# Altium schematic sheet Core.SchDoc: Wacky2021 AD19 HAT test
size A3; DrawnBy: Fletcher Walmsley; Address1: ECE Department; Address2: University of Canterbury; Address3: Christchurch 8041; Address4: New Zealand; Revision: 1
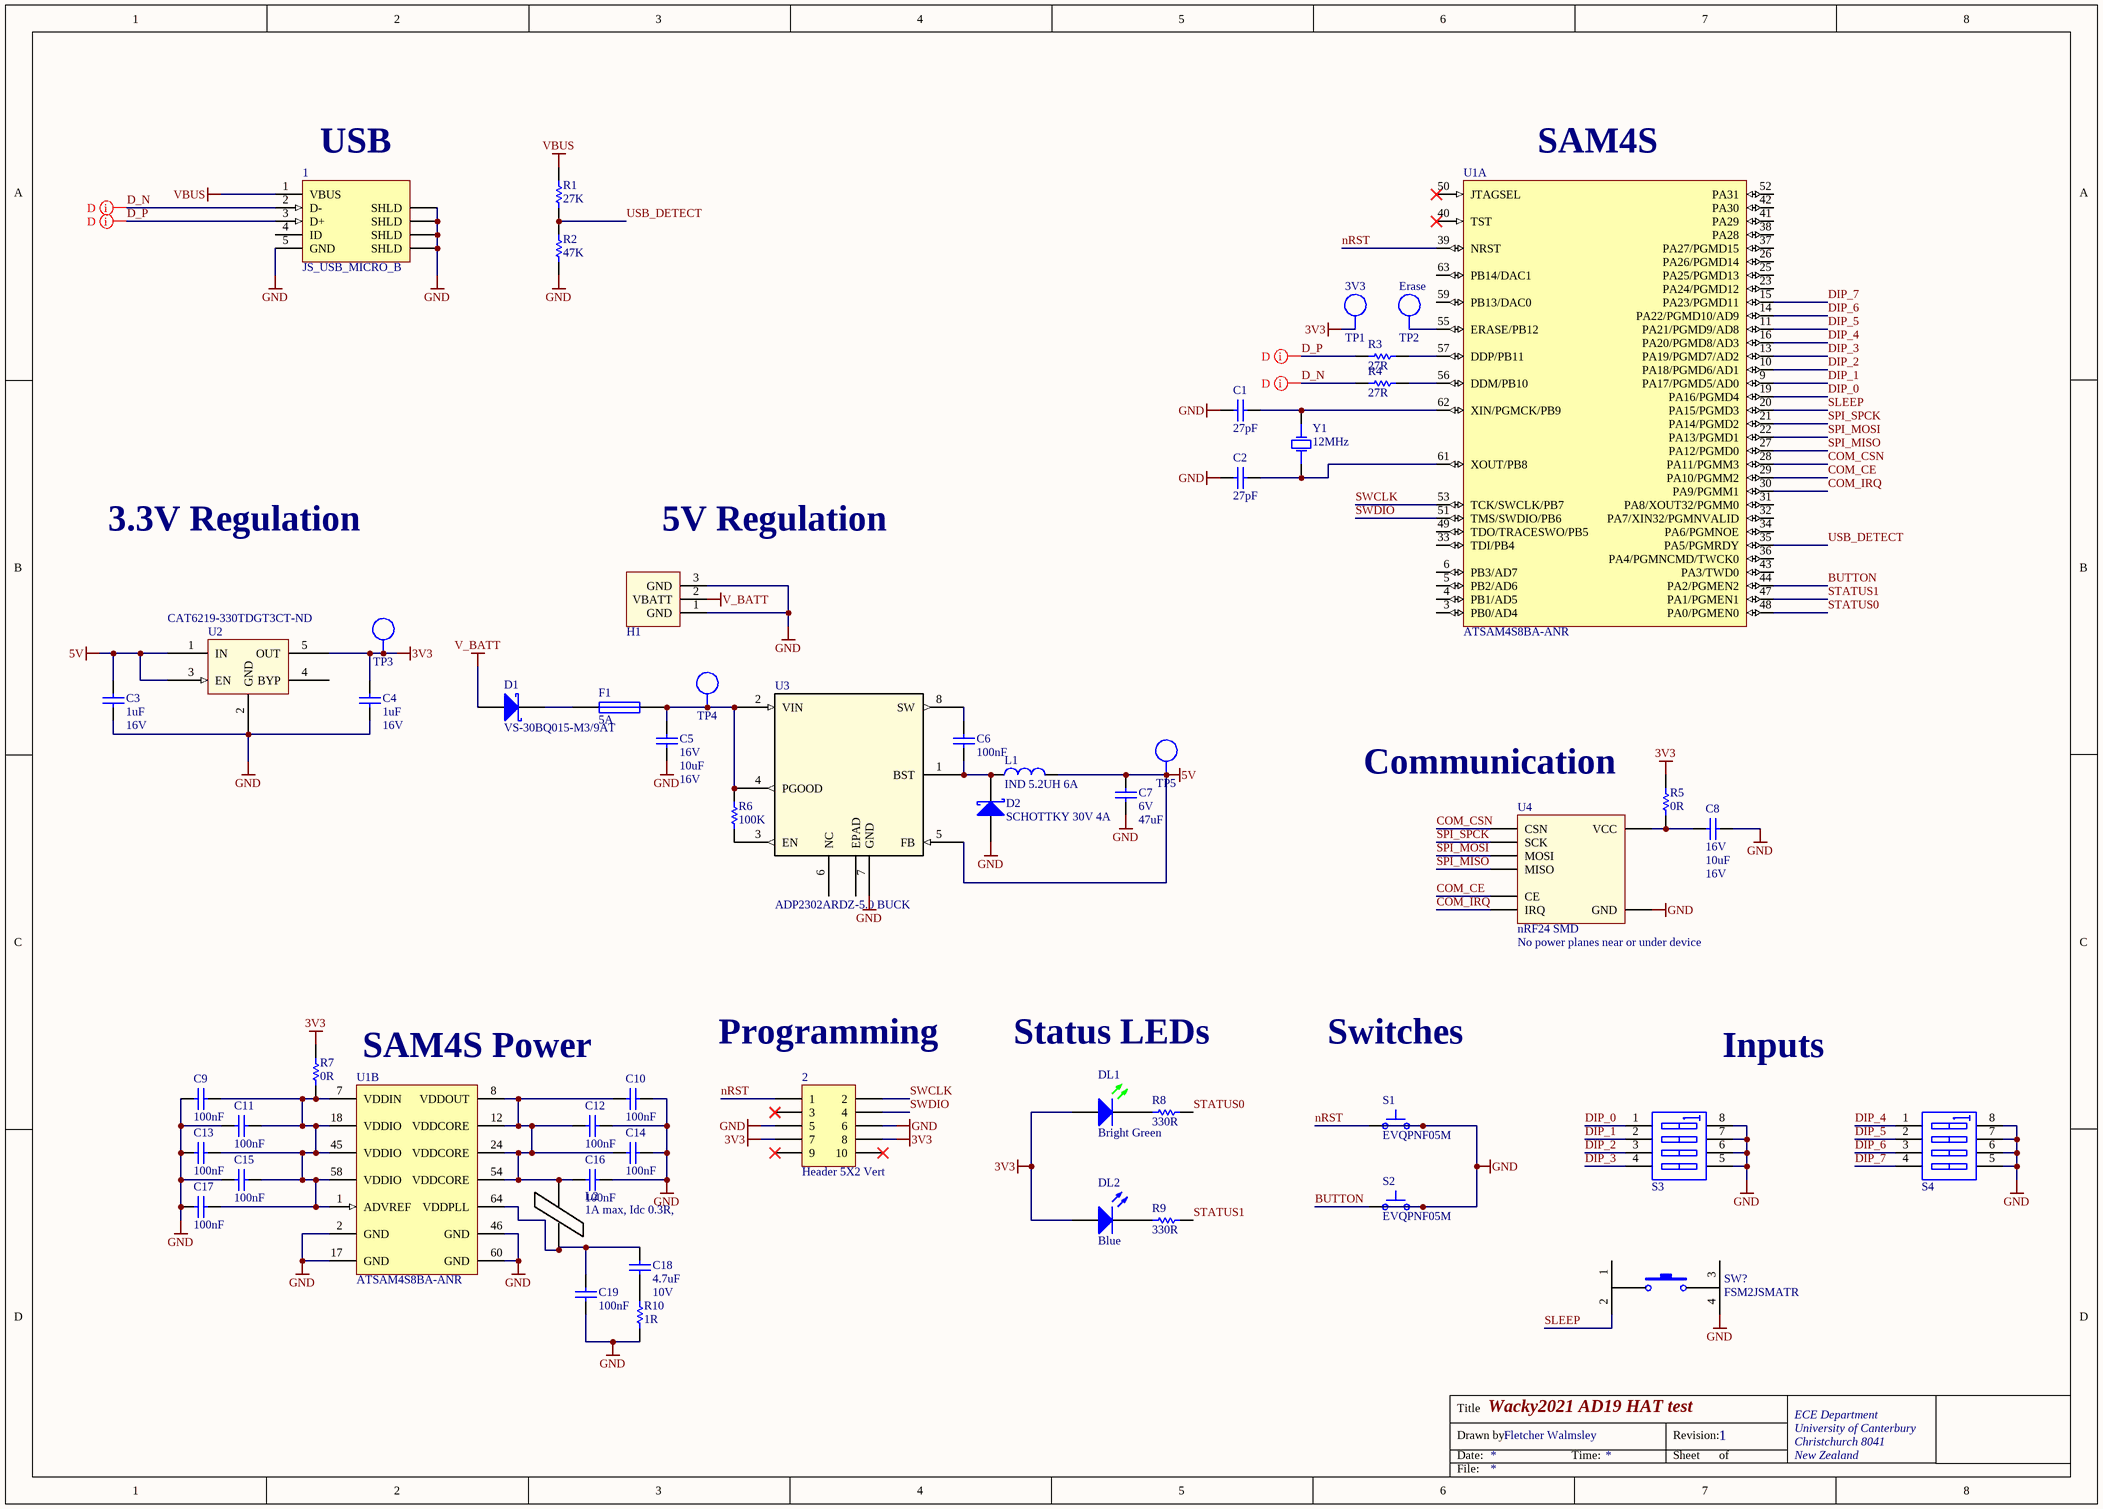
[diagram p0: Core.SchDoc]

## Parts
1  JS_USB_MICRO_B  [FCI_USB_10118194-0001LF]
2  Header 5X2 Vert  [IDC2.54-V10D]
C1  27pF  [CAPC1608L]
C2  27pF  [CAPC1608L]
C3  Max Voltage: 16V  [CAPC1608L]  (hidden comment: 1uF)
C4  Max Voltage: 16V  [CAPC1608L]  (hidden comment: 1uF)
C5  Voltage - Rated: 16V  [CAPC2012L]  (hidden comment: 10uF)
C6  100nF  [CAPC1608L]
C7  Max Voltage: 6V  [CAPC3216L]  (hidden comment: 47uF)
C8  Voltage - Rated: 16V  [CAPC2012L]  (hidden comment: 10uF)
C9  100nF  [CAPC1608L]
C10  100nF  [CAPC1608L]
C11  100nF  [CAPC1608L]
C12  100nF  [CAPC1608L]
C13  100nF  [CAPC1608L]
C14  100nF  [CAPC1608L]
C15  100nF  [CAPC1608L]
C16  100nF  [CAPC1608L]
C17  100nF  [CAPC1608L]
C18  Max Voltage: 10V  [CAPC1608N]  (hidden comment: 4.7uF)
C19  100nF  [CAPC1608L]
D1  VS-30BQ015-M3/9AT  [SMC]
D2  SCHOTTKY 30V 4A  [SMC]
DL1  Bright Green  [WL-SMCW0603]
DL2  Blue  [WL-SMCW0603]
F1  5A  [RESC3216N]
H1  Battery_HEADER_3pin  [BATT_HEADER_3POS]  (value not drawn)
L1  IND 5.2UH 6A  [INDUCTOR5u2]
L2  1A max, Idc 0.3R,  [INDC3216L]
R1  27K  [RESC1608L]
R2  47K  [RESC1608N]
R3  27R  [RESC1608L]
R4  27R  [RESC1608L]
R5  0R  [RESC1608L]
R6  100K  [RESC1608L]
R7  0R  [RESC1608L]
R8  330R  [RESC1608L]
R9  330R  [RESC1608L]
R10  1R  [RESC3216L]
S1  EVQPNF05M  [EVQPNF05M]
S2  EVQPNF05M  [EVQPNF05M]
S3  WS_SW DIP-4  [DIP_SW_4WAY_SMD -]  (value not drawn)
S4  WS_SW DIP-4  [DIP_SW_4WAY_SMD -]  (value not drawn)
SW?  FSM2JSMATR  [FSM2JSMA]
TP1  3V3  [TP_1206]  (no BOM)
TP2  Erase  [TP_1206]  (no BOM)
TP3  TP  [TP_1206]  (value not drawn)  (no BOM)
TP4  TP  [TP_1206]  (value not drawn)  (no BOM)
TP5  TP  [TP_1206]  (value not drawn)  (no BOM)
U1  ATSAM4S8BA-ANR  [LQFP64_L]  (parts A,B of 2)
U2  Supplier Part Number: CAT6219-330TDGT3CT-ND  [SOT95P280X145-5N]  (hidden comment: CAT6219-330TDGT3)
U3  ADP2302ARDZ-5.0 BUCK  [RD_8_1]
U4  nRF24 SMD  Warning: No power planes near or under device  [NRF24]
Y1  12MHz  [6.0X3.5-4]

## Nets
3V3: 2.7 2.8 C4.2 DL1.2(A) DL2.2(A) R5.2 R7.2 TP1.1 TP3.1 U2.5(OUT)
5V: C3.2 C7.2 L1.2 TP5.1 U2.1(IN) U2.3(EN) U3.5(FB)
GND: 1.5(GND) 1.6(SHLD) 2.5 2.6 C1.1 C2.1 C3.1 C4.1 C5.1 C7.1 C8.1 C9.1 C10.2 C11.1 C12.2 C13.1 C14.2 C15.1 C16.2 C17.1 C19.1 D2.1(A) H1.1(GND) H1.3(GND) R2.1 R10.1 S1.2 S2.2 S3.5(B4) S3.6(B3) S3.7(B2) S3.8(B1) S4.5(B4) S4.6(B3) S4.7(B2) S4.8(B1) SW?.4 U1.2(GND) U1.17(GND) U1.46(GND) U1.60(GND) U2.2(GND) U3.7(GND) U4.2(GND)
V_BATT: D1.1(A) H1.2(VBATT)
VBUS: 1.1(VBUS) R1.2
BUTTON: S2.1 U1.44(PA2/PGMEN2)
COM_CE: U1.29(PA10/PGMM2) U4.3(CE)
COM_CSN: U1.28(PA11/PGMM3) U4.4(CSN)
COM_IRQ: U1.30(PA9/PGMM1) U4.8(IRQ)
D_N: 1.2(D-) R4.1
D_P: 1.3(D+) R3.1
DIP_0: S3.1(A1) U1.19(PA16/PGMD4)
DIP_1: S3.2(A2) U1.9(PA17/PGMD5/AD0)
DIP_2: S3.3(A3) U1.10(PA18/PGMD6/AD1)
DIP_3: S3.4(A4) U1.13(PA19/PGMD7/AD2)
DIP_4: S4.1(A1) U1.16(PA20/PGMD8/AD3)
DIP_5: S4.2(A2) U1.11(PA21/PGMD9/AD8)
DIP_6: S4.3(A3) U1.14(PA22/PGMD10/AD9)
DIP_7: S4.4(A4) U1.15(PA23/PGMD11)
nRST: 2.1 S1.1 U1.39(NRST)
SLEEP: SW?.2 U1.20(PA15/PGMD3)
SPI_MISO: U1.27(PA12/PGMD0) U4.7(MISO)
SPI_MOSI: U1.22(PA13/PGMD1) U4.6(MOSI)
SPI_SPCK: U1.21(PA14/PGMD2) U4.5(SCK)
STATUS0: R8.2 U1.48(PA0/PGMEN0)
STATUS1: R9.2 U1.47(PA1/PGMEN1)
SWCLK: 2.2 U1.53(TCK/SWCLK/PB7)
SWDIO: 2.4 U1.51(TMS/SWDIO/PB6)
USB_DETECT: R1.1 R2.2 U1.35(PA5/PGMRDY)
NetC1_2: C1.2 U1.62(XIN/PGMCK/PB9) Y1.3(OSC2)
NetC2_2: C2.2 U1.61(XOUT/PB8) Y1.1(OSC1)
NetC5_2: C5.2 F1.2 R6.2 TP4.1 U3.2(VIN) U3.4(PGOOD)
NetC6_1: C6.1 D2.2(K) L1.1 U3.1(BST)
NetC6_2: C6.2 U3.8(SW)
NetC8_2: C8.2 R5.1 U4.1(VCC)
NetC9_2: C9.2 C11.2 C13.2 C15.2 C17.2 R7.1 U1.1(ADVREF) U1.7(VDDIN) U1.18(VDDIO) U1.45(VDDIO) U1.58(VDDIO)
NetC10_1: C10.1 C12.1 C14.1 C16.1 L2.2 U1.8(VDDOUT) U1.12(VDDCORE) U1.24(VDDCORE) U1.54(VDDCORE)
NetC18_1: C18.1 R10.2
NetC18_2: C18.2 C19.2 L2.1 U1.64(VDDPLL)
NetD1_2: D1.2(K) F1.1
NetDL1_1: DL1.1(K) R8.1
NetDL2_1: DL2.1(K) R9.1
NetR3_2: R3.2 U1.57(DDP/PB11)
NetR4_2: R4.2 U1.56(DDM/PB10)
NetR6_1: R6.1 U3.3(EN)
NetTP2_1: TP2.1 U1.55(ERASE/PB12)

Not connected (* = marked no-connect by the designer): 1 4(ID); 2 3* 9* 10*; SW? 1 3; U1 3(PB0/AD4) 4(PB1/AD5) 5(PB2/AD6) 6(PB3/AD7) 23(PA24/PGMD12) 25(PA25/PGMD13) 26(PA26/PGMD14) 31(PA8/XOUT32/PGMM0) 32(PA7/XIN32/PGMNVALID) 33(TDI/PB4) 34(PA6/PGMNOE) 36(PA4/PGMNCMD/TWCK0) 37(PA27/PGMD15) 38(PA28) 40(TST)* 41(PA29) 42(PA30) 43(PA3/TWD0) 49(TDO/TRACESWO/PB5) 50(JTAGSEL)* 52(PA31) 59(PB13/DAC0) 63(PB14/DAC1); U2 4(BYP); U3 6(NC) EPAD

## Layout directives
differential pair: D_N, D_P

## Notes on the sheet
- (near 1) USB
- (near U1) SAM4S
- 3.3V Regulation
- (near H1) 5V Regulation
- Communication
- (near U1) SAM4S Power
- (near 2) Programming
- Status LEDs
- Switches
- Inputs
- Title
- Drawn by:
- Date:
- Time:
- Revision:
- Sheet
- of
- File:

## Library data of the parts
1 = JS_USB_MICRO_B_SMT: CONN USB MICRO B RECPT SMT R/A; Manufacturer: FCI; Manufacturer Part Number: 10118194-0001LF; Gender: Receptacle; Number of Contacts: 5; Specifications: USB 2.0; Supplier 1: Digi-Key; Supplier Part Number 1: 609-4618-1-ND; Features: Shielded, Solder Retention; Mounting Type: Surface Mount, Right Angle, Horizontal
2 = JA_HDR_IDC_5X2_VERT: IDC Header, 2,54mm, 10-Pin, Vert; Supplier: ECE Dept; Supplier 1: Farnell; Supplier Part Number 1: 1096985; Storage Location: ECE Dept Store
C1 C2 = CC_27pF_0603: CAP CER 27pF NPO/COG +-5% 50V 0603; PackageReference: 0603; Code_IPC: 1608 [0603]; Verify: *; Supplier: ECE Dept; Storage Location: PCB Assembly WS; Value: 27pF
C3 C4 = CC_1uF_0603: CAP CER 1uF Y5V -20% +80% 16V 0603; PackageReference: 0603; Code_IPC: 1608 [0603]; Verify: *; Supplier: ECE Dept; Storage Location: PCB Assembly WS; Value: 1uF
C5 C8 = CC_10uF_16V_0805: CAP CER 10uF X5R 16V 0805; Manufacturer: Samsung Electro-Mechanics; Manufacturer Part Number: CL21A106KOQNNWE; Note: Footprint corresponds to dimensions for bulk cassette packaging. This case size has tightened tolerances.; Tolerance: ±10%; Notification: Current market demand for these product types have resulted in fluctuating and extending lead times. Lead times may differ.; PackageReference: 0805; Code_IPC: 2012[0805]; Supplier 1: Digi-Key; RoHS: RoHS Compliant; Category: Capacitors; Stock 1: 20000; Pricing 1: 1=0.35, 10=0.25, 100=0.1178, 500=0.08254, 1000=0.06831 (NZD); Packaging: Cut Tape (CT); Part Status: Active; Temperature Coefficient: X5R; Operating Temperature: -55°C ~ 85°C; Features: -; Ratings: -; Applications: General Purpose; Mounting Type: Surface Mount, MLCC; Package / Case: 0805 (2012 Metric); Size / Dimension: 0.079" L x 0.049" W (2.00mm x 1.25mm); Height - Seated (Max): -; Thickness (Max): 0.055" (1.40mm); Lead Spacing: -; Lead Style: -; ComponentLink1URL: http://www.samsungsem.com/kr/support/product-search/mlcc/CL21A106KOQNNWE.jsp; ComponentLink1Description: http://www.samsungsem.com/kr/support/product-search/mlcc/CL21A106KOQNNWE.jsp; Supplier Part Number 1: 1276-2894-1-ND; Value: 10uF; Max Voltage: 16V
C6 C9-C17 C19 = CC_100nF_0603: CAP CER 100nF X7R +-10% 50V 0603; PackageReference: 0603; Code_IPC: 1608 [0603]; Verify: *; Supplier: ECE Dept; Storage Location: PCB Assembly WS; Value: 100nF
C7 = CC_47uF_1206: CAP CER 47uF X5R -/+20% 6V 1206; Verify: *; Supplier: ECE Dept; Storage Location: PCB Assembly WS; Dielectric: X5R; Footprint: 1210 (3225 metric); MoV: 6V; Value: 47uF
C18 = CC_4.7uF_0603: CAP CER 4.7uF X5R +-20%  10V 0603; Note: Footprint corresponds to dimensions for bulk cassette packaging. This case size has tightened tolerances.; PackageReference: 0805; Code_IPC: 2012[0805]; Verify: *; Supplier: ECE Dept; Storage Location: PCB Assembly WS; Value: 4.7uF
D1 = DS_VS-30BQ015-M3: DIODE, SCHOTTKY, 3A, 15V, DO-214AB / SMC; Manufacturer: Vishay Semiconductors; Forward Voltage: 350mV; Max Forward Surge Current (Ifsm): 650A; Peak Reverse Current: 4mA; Average Rectified Current: 3A; Max Reverse Voltage (DC): 15V; Supplier: Digi-Key; ComponentLink1URL: https://datasheet.ciiva.com/36181/vs-30bq015-m3-9at-36181258.pdf; ComponentLink1Description: https://datasheet.ciiva.com/36181/vs-30bq015-m3-9at-36181258.pdf; Supplier 1: Digi-Key; Supplier 2: Element14; Supplier Part Number 1: VS-30BQ015-M3/9ATGIDKR-ND; Supplier Part Number 2: 2628288; Supplier Part Number: VS-30BQ015-M3/9AT-ND; Manufacturer Part Number: VS-30BQ015-M3/9AT
D2 = MBRS330T3G: DIODE SCHOTTKY 30V 4A SMC; Manufacturer: ON Semiconductor; Speed: Fast Recovery =< 500ns, > 200mA (Io); Supplier 1: Digi-Key; Manufacturer Part Number: MBRS330T3G; RoHS: RoHS Compliant; Category: Discrete Semiconductor Products; Stock 1: 8919; Pricing 1: 1=0.93, 10=0.79, 100=0.5902, 500=0.46368, 1000=0.35829 (NZD); Packaging: Cut Tape (CT); Part Status: Active; Diode Type: Schottky; Current - Average Rectified (Io): 4A; Capacitance @ Vr, F: -; Mounting Type: Surface Mount; Package / Case: DO-214AB, SMC; Supplier Device Package: SMC; Operating Temperature - Junction: -65°C ~ 150°C; Base Part Number: MBRS330; ComponentLink1URL: http://www.onsemi.com/pub/Collateral/MBRS340T3-D.PDF; ComponentLink1Description: http://www.onsemi.com/pub/Collateral/MBRS340T3-D.PDF; Supplier Part Number 1: MBRS330T3GOSCT-ND
DL1 = DL_150060VS75000: LED Bright Green 40mcd 0603 SMD; Manufacturer: WURTH ELEKTRONIK; Forward Current If: 30; Forward Voltage: 2; Viewing Angle: 140°; Wavelength Typ: 570; Luminous Intensity: 40; LED Mounting: SMD; Supplier 1: Farnell; Supplier Part Number 1: 2322073; Manufacturer Part Number: 150060VS75000; Storage Location: PCB Assembly WS; Supplier: ECE Dept; LED Colour: Bright Green
DL2 = DL_150060BS75000: LED Blue 270mcd 0603 SMD; Manufacturer: WURTH ELEKTRONIK; Forward Current If: 30; Forward Voltage: 3.2; Luminous Intensity: 270; Viewing Angle: 120°; Wavelength Typ: 470; Pricing: 1=0.3844, 50=0.3252, 100=0.2957, 500=0.2365 (NZD); Supplier 1: Farnell; Supplier Part Number 1: 2322069; Manufacturer Part Number: 150060BS75000; Storage Location: PCB Assembly WS; Supplier: ECE Dept; LED Colour: Blue
F1 = FS_Fuse_5.0A: Fuse 5.0A Fast Acting 1206 SMD; Manufacturer Part Number: C1F5; Manufacturer: Bel TRP; Voltage Rating (AC): 125V; Voltage Rating (DC): 63V; DC Cold Resistance: 19mR; Fuse Type: Board Mount (Cartridge Style Excluded); Approvals: CE,cURus; Mount: Surface Mount; Case/Package: 1206; Number of Pins: 2; Case Code (Metric): 3216; Case Code (Imperial): 1206; Contact Plating: Nickel,Tin; Min Operating Temperature: -55°C; Max Operating Temperature: 125°C; Packaging: Tape and Reel; Voltage Rating: 125V; Length: 0.126inch; Width: 0.062inch; Supplier 1: Digi-Key; Stock 1: 725; Pricing 1: 1=0.32, 5=0.312, 10=0.298, 50=0.2662, 100=0.2479, 250=0.22032, 500=0.1836, 1000=0.17442 (USD); ComponentLink1URL: http://www.farnell.com/datasheets/2571625.pdf; ComponentLink1Description: http://www.farnell.com/datasheets/2571625.pdf; ComponentLink2URL: http://belfuse.com/pdfs/C1F.pdf; ComponentLink2Description: http://belfuse.com/pdfs/C1F.pdf; ComponentLink3URL: http://www.mouser.com/ds/2/643/C1F-594910.pdf; ComponentLink3Description: http://www.mouser.com/ds/2/643/C1F-594910.pdf; ComponentLink4URL: https://belfuse.com/resources/StewartConnector/C1F.pdf; ComponentLink4Description: https://belfuse.com/resources/StewartConnector/C1F.pdf; Current Rating: 5A; Supplier Part Number 1: 507-1886-1-ND; Supplier 2: Element14; Supplier Part Number 2: 2848595; Value: 5A
H1 = Battery_HEADER_3pin: 3Pin Header 2.54mm spacing
L1 = CDRH104RNP-5R2NC: FIXED IND 5.2UH 6A 22 MOHM SMD; Manufacturer: Sumida America Components Inc.; Material - Core: Ferrite; Tolerance: ±30%; Current - Saturation: 5.6A; Shielding: Shielded; DC Resistance (DCR): 22 mOhm Max; Supplier 1: Digi-Key; Manufacturer Part Number: CDRH104RNP-5R2NC; RoHS: RoHS Compliant; Category: Inductors, Coils, Chokes; Stock 1: 3849; Pricing 1: 1=2.9, 10=2.678, 100=1.8743, 500=1.5173 (NZD); Packaging: Cut Tape (CT); Part Status: Active; Type: -; Q @ Freq: -; Frequency - Self Resonant: -; Ratings: -; Operating Temperature: -40°C ~ 100°C; Mounting Type: Surface Mount; Package / Case: Nonstandard; Supplier Device Package: -; Size / Dimension: 0.402" L x 0.394" W (10.20mm x 10.00mm); Height - Seated (Max): 0.157" (4.00mm); ComponentLink1URL: http://products.sumida.com/products/pdf/CDRH104R.pdf; ComponentLink1Description: http://products.sumida.com/products/pdf/CDRH104R.pdf; Supplier Part Number 1: 308-2280-1-ND
L2 = IN_Ferrite-Bead: Ferrite Bead, Rdc 0.3R, Z100MHZ 600R, Imax 1A, SMD 1206; Manufacturer: FAIR-RITE; Manufacturer PN: 2512066017Y1; DC Current Rating: 1; DC Resistance Max: 0.08; Ferrite Case Style: 1206 ^3216 Metric]; Frequency Range: 50MHz to 1; Impedance: 600; Impedance Tolerance: ± 25%; Supplier: ECE Dept; Storage Location: PCB Assembly WS; Ferrite Mounting: SMD; Supplier 1: Farnell; Supplier Part Number 1: 1612060; Manufacturer Part Number: 2512066017Y1; Value: 1A max, Idc 0.3R,
R1 = RS_27K: RES 27K OHM 1/10W 5% 0603 SMD; Storage Location: PCB Assembly WS; Supplier: ECE Dept; Value: 27K
R2 = RS_47K: RES 47.0K OHM 1/10W 5% 0603 SMD; Storage Location: PCB Assembly WS; Supplier: ECE Dept; Value: 47K
R3 R4 = RS_27R: RES 27 OHM 1/10W 5% 0603 SMD; Storage Location: PCB Assembly WS; Supplier: ECE Dept; Value: 27R
R5 R7 = RS_0R0: RES 0.0 OHM 1/10W 5% 0603 SMD; Storage Location: PCB Assembly WS; Supplier: ECE Dept; Value: 0R
R6 = RS_100K: RES 100K OHM 1/10W 5% 0603 SMD; Storage Location: PCB Assembly WS; Supplier: ECE Dept; Value: 100K
R8 R9 = RS_330R: RES 330 OHM 1/10W 5% 0603 SMD; Storage Location: PCB Assembly WS; Supplier: ECE Dept; Value: 330R
R10 = RT_1R: RES 1R OHM 1/4W 5% 1206 SMD; Storage Location: PCB Assembly WS; Supplier: ECE Dept; Value: 1R
S1 S2 = WS_EVQPNF05M: Panasonic 6 x 3.5mm SMD Light Touch Switch Type SMD; PackageDescription: 6.0 x 3.5 mm; Supplier 1: Farnell; Supplier Part Number 1: 2079481; Manufacturer: Panasonic; Manufacturer PN: EVQPNF05M; Supplier 2: Digi-Key; Supplier Part Number 2: P13598SCT-ND; Storage Location: PCB Assembly WS; Supplier: ECE Dept
S3 S4 = WS_SW DIP-4: DIP Switch, 4 Position, SPST SMD; Manufacturer: OMRON ELECTRONIC COMPONENTS; Manufacturer Part Number: A6SN-4101; Contact Current DC Max: 25; External Length / Height: 12.1; No. of Switch Positions: 4; Pitch Spacing: 2.54; Contact Configuration: SPST; Supplier 1: Farnell; Supplier Part Number 1: 2029425; Storage Location: PCB Assembly WS; Supplier: ECE Dept
SW? = WS_FSM2JSMATR: SWITCH TACTILE SPST-NO 0.05A 12V SMD; Manufacturer: TE Connectivity; Actuator Height off PCB, from Pins: 4.30mm; Actuator Orientation: Top Actuated; Contact Rating @ Voltage: 0.05A @ 12VDC; Operating Force: 160gf; Outline: 6.00mm x 6.00mm; Supplier 1: Farnell; Supplier 2: Digi-Key; Circuit: SPST-NO; Pricing: 1=0.55, 10=0.518, 25=0.4444, 50=0.3778, 100=0.363, 250=0.32592, 500=0.31108 (NZD); Supplier Part Number 1: 1570392; Supplier Part Number 2: 450-1757-1-ND; Storage Location: PCB Assembly WS; Supplier: ECE Dept; Manufacturer Part Number: FSM2JSMATR
TP1 TP2 = TP_1206: Test-Point 3.3x1.6x2.1mm SMD; Manufacturer: Harwin Inc; Manufacturer Part Number: S1751-46R; Value: TP; Manufacturer PN: *; Storage Location: ProtoPlace; Mounting Type: Surface Mount; Type: PC Test Point; Supplier 1: Digi-Key; Supplier Part Number 1: 952-1478-2-ND; Supplier 2: Farnell; Supplier Part Number 2: 1826282; Supplier: ECE Dept
TP3-TP5 = TP_1206: Test-Point 3.3x1.6x2.1mm SMD; Manufacturer: Harwin Inc; Manufacturer Part Number: S1751-46R; Manufacturer PN: *; Storage Location: ProtoPlace; Mounting Type: Surface Mount; Type: PC Test Point; Supplier 1: Digi-Key; Supplier Part Number 1: 952-1478-2-ND; Supplier 2: Farnell; Supplier Part Number 2: 1826282; Supplier: ECE Dept; Value: TP
U1 = SE_ATSAM4S16BA-MU: IC MCU 32BIT 512KB FLASH 64LQFP; Manufacturer: Atmel; Connectivity: I²C, IrDA, Memory Card, SPI, SSC, UART/USART, USB; Core Processor: ARM® Cortex®-M4; Core Size: 32-Bit; Data Converters: A/D 11x12b, D/A 2x12b; Number of I/O: 47; Peripherals: Brown-out Detect/Reset, DMA, POR, PWM, WDT; Program Memory Size: 512KB (512K x 8); RAM Size: 128K x 8; Speed: 120MHz; Voltage - Supply (Vcc/Vdd): 1.62 V ~ 3.6 V; PackageVersion: revJ, Jul-2007; PackageReference: 64PS; PackageDescription: 64-Pin Quad Flat No-Lead (QFN) Sawn, 9 x 9 x 1.0 mm Body, 0.5 mm Pitch, Exposed Pad; Code_JEDEC: MO-220VMMD-3; ComponentLink1Description: Manufacturer URL; ComponentLink1URL: http://www.atmel.com/; ComponentLink2Description: SAM4S Series Datasheet; ComponentLink2URL: http://www.atmel.com/dyn/resources/prod_documents/11100.pdf; ComponentLink3Description: SAM4S Series Summary; ComponentLink3URL: http://www.atmel.com/dyn/resources/prod_documents/11100S.pdf; Supplier 1: Digi-Key; Package / Case: 64-LQFP; Packaging: Cut Tape (CT); Program Memory Type: FLASH; Supplier Part Number 1: ATSAM4S8BA-ANRCT-ND; Manufacturer Part Number: ATSAM4S8BA-ANR
U2 = SV_CAT6219-330TDGT3: IC REG LIN 3.3V 500MA TSOT23-5; Voltage - Input (Max): 5.5V; Voltage Dropout (Max): 0.5V @ 500mA; Manufacturer Part Number: CAT6219-330TDGT3; Base Part Number: CAT6219; Current - Output: 500mA; Package / Case: SOT-23-5 Thin, TSOT-23-5; Supplier: Digi-Key; Supplier Device Package: TSOT-23-5; Voltage - Output (Min/Fixed): 3.3V; ComponentLink1URL: http://www.onsemi.com/pub/Collateral/CAT6219-D.PDF; ComponentLink1Description: http://www.onsemi.com/pub/Collateral/CAT6219-D.PDF; Supplier 1: Digi-Key
U3 = ADP2302ARDZ-5.0-R7: IC REG BUCK 5V 2A 8SOIC; Vendor: Analog Devices Inc; Frequency - Switching: 700kHz; Output Type: Fixed; Voltage - Input (Max): 20V; Manufacturer_Part_Number: ADP2302ARDZ-5.0-R7; Type: DEV; Value: Value; Supplier 1: Digi-Key; Current - Output: 2A; Voltage - Output (Min/Fixed): 5V; Supplier Part Number 1: ADP2302ARDZ-5.0-R7CT-ND
U4 = NRF24: nRF24 SMD Module
Y1 = XT_CRYSTAL_12MHz_18pF: CRYSTAL 12MHZ 18PF 6X3.5mm SMD; Manufacturer: CTS-Frequency Controls; Manufacturer Part Number: 406C35D12M00000; ESR (Equivalent Series Resistance): 60 Ohm; Frequency Stability: ±50ppm; Frequency Tolerance: ±30ppm; Operating Mode: Fundamental; Supplier 1: Digi-Key; Height: 0.047" (1.20mm); Load Capacitance: 18pF; Mounting Type: Surface Mount; Operating Temperature: -20°C ~ 70°C; Package / Case: 4-SMD, No Lead (DFN, LCC); Size / Dimension: 0.236" L x 0.138" W (6.00mm x 3.50mm); Supplier Part Number 1: CTX855CT-ND; Frequency: 12MHz